# EAGLE design BUZZI-28 (EAGLE 4.15)
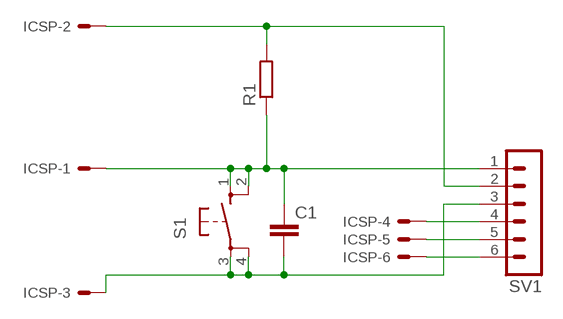
[diagram p0: schematic, sheet 1]

## Parts
C1  C-EUC0805K  [C0805K]
ICSP  53047-06  [53047-06]
R1  R-EU_R0805  [R0805]
S1  10XX  [B3F-10XX]
SV1  MA06-1  [MA06-1]

## Nets
MCLR: C1.1 ICSP.1 R1.1 S1.1 S1.2 SV1.1
N$2: ICSP.2 R1.2 SV1.2
N$3: C1.2 ICSP.3 S1.3 S1.4 SV1.3
N$4: ICSP.4 SV1.4
N$5: ICSP.5 SV1.5
N$6: ICSP.6 SV1.6

## Library data of the parts
C1 = rcl:C-EU: CAPACITOR, European symbol
ICSP = con-molex:53?-06: CONNECTOR wire to board 1.25 mm (.049 inch) pitch header
R1 = rcl:R-EU_: RESISTOR, European symbol
S1 = KEY_B:10XX
SV1 = con-lstb:MA06-1: PIN HEADER

## Board
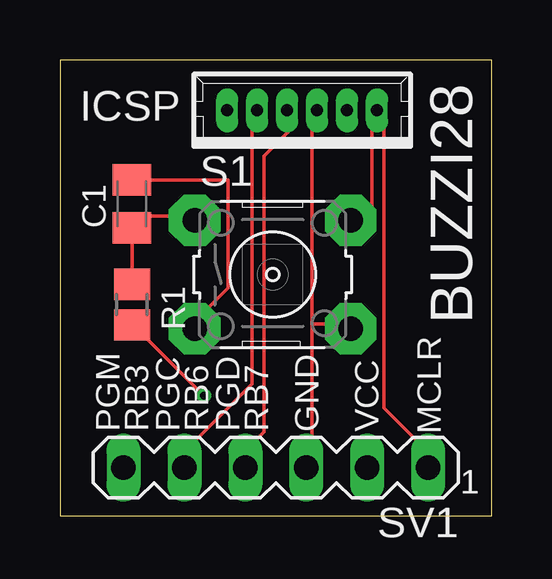
[diagram p1: board, top side]
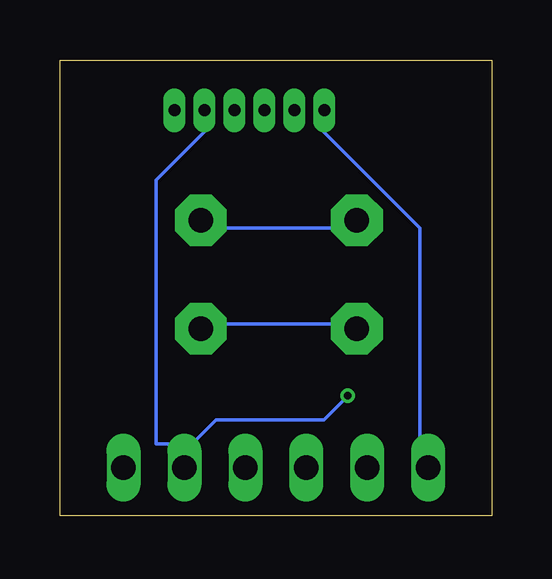
[diagram p2: board, bottom side, seen from below]

Size 18 x 19 mm. Coordinates in mm from the lower left corner, seen from the top.
Outline: 0,0 18,0 18,19 0,19 0,0
Copper layers (1*16): Top 0.035mm / dielectric 1.5mm / Bottom 0.035mm
Design rules "PCB-POOL": minimum track width 6mil, minimum drill 12mil, track to track 6mil, track to pad 6mil, pad to pad 6mil, via to via 6mil, smd to smd 6mil, copper to edge 20mil, drill to drill 8mil, minimum pad ring 8mil, minimum via ring 6mil, stop-mask expansion 3mil, vias tented up to drill 0mil, thermal gap 8mil

### Footprints (pad centres in the part's own frame; a part is rotated, then mirrored left to right if it is on the bottom)
C0805K = smd 1.3 x 1.6: 1 -1,0; 2 1,0
53047-06 = drill 0.5 pad 0.698 long: 1 3.125,0; 2 1.875,0; 3 0.625,0; 4 -0.625,0; 5 -1.875,0; 6 -3.125,0
R0805 = smd 1.3 x 1.5: 1 -0.85,0; 2 0.85,0
B3F-10XX = drill 1.016 pad 2.159 octagon: 1 -3.379,2.312; 2 3.123,2.312; 3 -3.379,-2.209; 4 3.123,-2.209
MA06-1 = drill 1.016 long: 1 -6.35,0; 2 -3.81,0; 3 -1.27,0; 4 1.27,0; 5 3.81,0; 6 6.35,0

### Placement (x,y rotation side)
C1  3,13 90 top
ICSP  10.1,16.9 0 top
R1  3,8.8 270 top
S1  9,10 0 top
SV1  9,2 180 top

### Tracks (layer width: path | path; a pad name or v marks a point on that pad's centre or on a via)
MCLR
  Top 0.152: R1.1 C1.1 3.5,12.5 5,12.5 S1.1 | S1.2 13,12.5 13,16.5 ICSP.1 13.5,16.5 13.5,4.5 15,3 SV1.1
  Bottom 0.152: S1.1 6.5,12 11.5,12 S1.2
N$2  (via drill 0.3)
  Top 0.152: v6,5 3.5,7.5 R1.2
  Bottom 0.152: v6,5 7,4 11.5,4 12.5,3 SV1.2 13.5,3 14,3 14,14 12,16 ICSP.2
N$3
  Top 0.152: C1.2 7,14 7,9.5 6,8.5 S1.3 | 10.5,8 10.5,3 SV1.3 | 10.5,8 10.5,16.5 ICSP.3 | 10.5,8 11.5,8 S1.4
  Bottom 0.152: S1.3 6.5,8 11.5,8 S1.4
N$4
  Top 0.152: ICSP.4 9.5,16 8.5,15 8.5,3.5 8,3 SV1.4
N$5
  Top 0.152: ICSP.5 8,16.5 8,5.5 5.5,3 SV1.5
N$6
  Bottom 0.152: ICSP.6 7,16 3,12 3,3 SV1.6

### Text on the board
tNames: BUZZI28 | PGM | RB3 | PGC | RB6 | PGD | RB7 | GND | VCC | MCLR